# EAGLE design frontpanel (EAGLE 5.10)
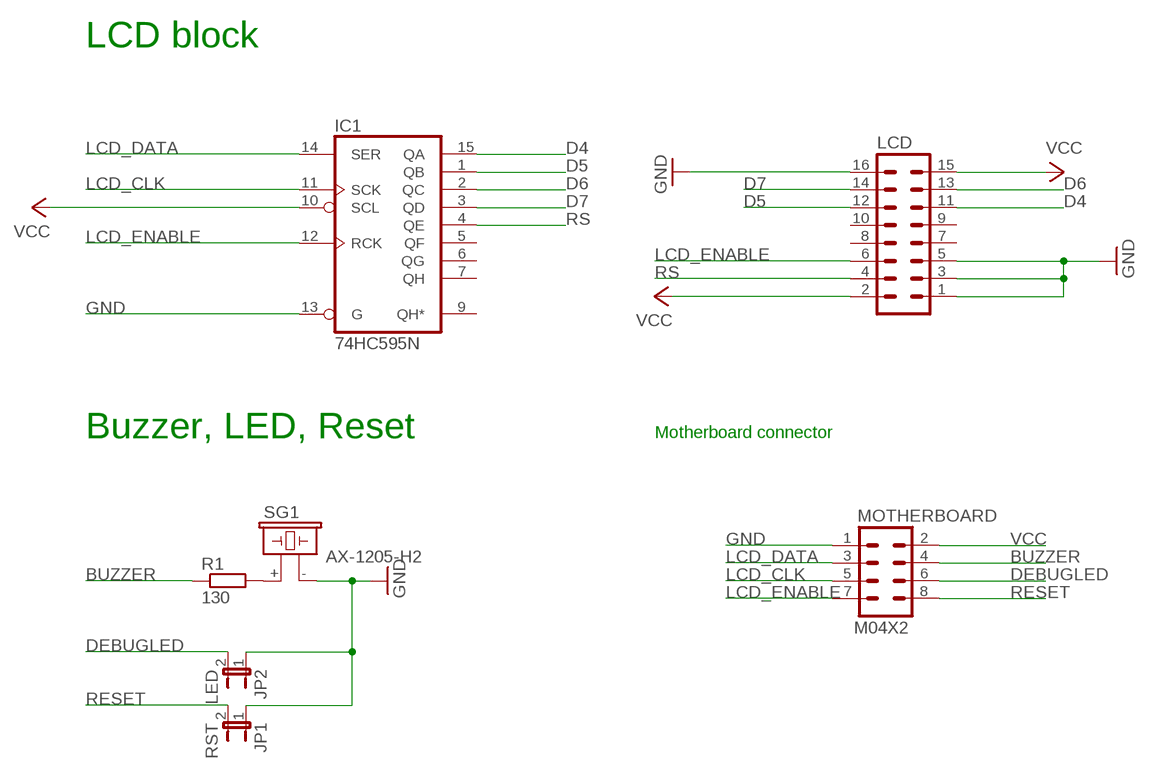
[diagram p0: schematic, sheet 1]

## Parts
IC1  74HC595N  [DIL16]
JP1  RST  JUMPER-2PTH  [1X02]
JP2  LED  JUMPER-2PTH  [1X02]
LCD  MA08-2  [MA08-2]
MOTHERBOARD  M04X2  [2X4]
R1  130  R-EU_0207/7  [0207/7]
SG1  AX-1205-H2  F/CM12P  [F/CM12P]

## Nets
BUZZER: MOTHERBOARD.4 R1.1
D4: IC1.15(QA) LCD.11
D5: IC1.1(QB) LCD.12
D6: IC1.2(QC) LCD.13
D7: IC1.3(QD) LCD.14
DEBUGLED: JP2.2 MOTHERBOARD.6
GND [GND]: IC1.13(G) JP1.1 JP2.1 LCD.1 LCD.3 LCD.5 LCD.16 MOTHERBOARD.1 SG1.-
LCD_CLK: IC1.11(SCK) MOTHERBOARD.5
LCD_DATA: IC1.14(SER) MOTHERBOARD.3
LCD_ENABLE: IC1.12(RCK) LCD.6 MOTHERBOARD.7
N$2: R1.2 SG1.+
RESET: JP1.2 MOTHERBOARD.8
RS: IC1.4(QE) LCD.4
VCC [VCC]: IC1.10(SCL) LCD.2 LCD.15 MOTHERBOARD.2
Unconnected: IC1.5(QF) IC1.6(QG) IC1.7(QH) IC1.9(QH*) LCD.7 LCD.8 LCD.9 LCD.10

## Notes on the sheet
- LCD block
- Buzzer, LED, Reset | Motherboard connector

## Power pins joined to a net without a drawn wire
GND: IC1.8(GND)
VCC: IC1.16(VCC)

## Library data of the parts
IC1 = 74xx-eu:74*595: 8-bit SHIFT REGISTER, output latch
JP1 JP2 = SparkFun:JUMPER-2: Jumper Basic 0.1" spaced jumper. Use with breakaway headers.
LCD = con-lstb:MA08-2: PIN HEADER
MOTHERBOARD = SparkFun:M04X2
R1 = resistor:R-EU_: RESISTOR, European symbol
SG1 = buzzer:F/CM12P: BUZZER Source: Buerklin

## Net classes
0 default: width 0.254 mm
1 GND: width 0.406 mm
2 VCC: width 0.406 mm

## Board
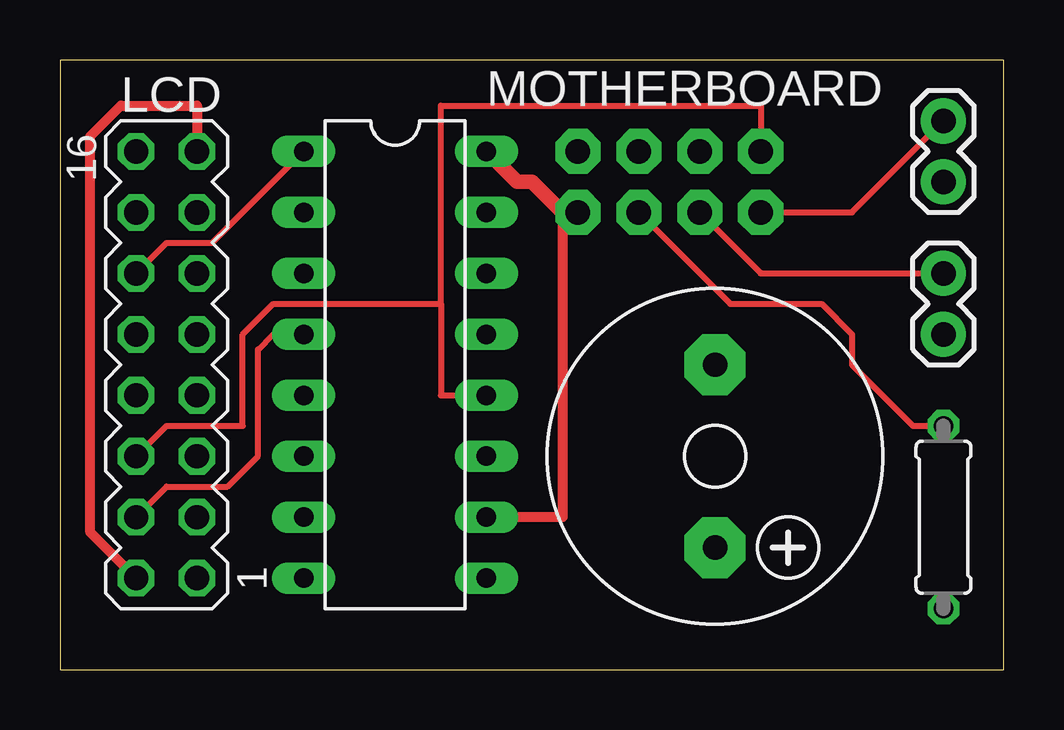
[diagram p1: board, top side]
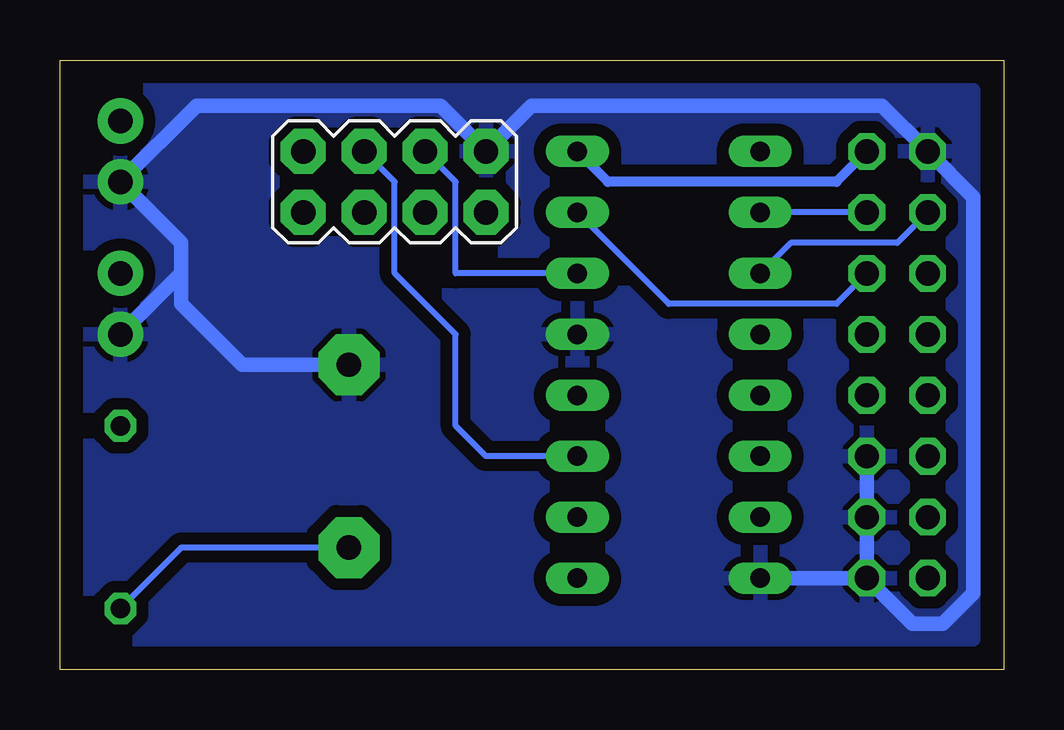
[diagram p2: board, bottom side, seen from below]

Size 39.35 x 25.4 mm. Coordinates in mm from the lower left corner, seen from the top.
Outline: 0,0 39.35,0 39.35,25.4 0,25.4 0,0
Copper layers (1*16): Top 0.018mm / dielectric 1.5mm / Bottom 0.018mm
Design rules "resonit_u18": minimum track width 0.15mm, minimum drill 0.6mm, track to track 0.15mm, track to pad 0.15mm, pad to pad 0.15mm, via to via 0.15mm, smd to smd 0.15mm, copper to edge 0.3mm, drill to drill 8mil, minimum pad ring 10mil, minimum via ring 8mil, stop-mask expansion 0.1mm, vias tented up to drill 0mil, thermal gap 10mil

### Footprints (pad centres in the part's own frame; a part is rotated, then mirrored left to right if it is on the bottom)
DIL16 = drill 0.813 long: 1 -8.89,-3.81; 2 -6.35,-3.81; 3 -3.81,-3.81; 4 -1.27,-3.81; 5 1.27,-3.81; 6 3.81,-3.81; 7 6.35,-3.81; 8 8.89,-3.81; 9 8.89,3.81; 10 6.35,3.81; 11 3.81,3.81; 12 1.27,3.81; 13 -1.27,3.81; 14 -3.81,3.81; 15 -6.35,3.81; 16 -8.89,3.81
1X02 = drill 1.016 pad 1.88 round: 1 0,0; 2 2.54,0
MA08-2 = drill 1.016 octagon: 1 -8.89,-1.27; 2 -8.89,1.27; 3 -6.35,-1.27; 4 -6.35,1.27; 5 -3.81,-1.27; 6 -3.81,1.27; 7 -1.27,-1.27; 8 -1.27,1.27; 9 1.27,-1.27; 10 1.27,1.27; 11 3.81,-1.27; 12 3.81,1.27; 13 6.35,-1.27; 14 6.35,1.27; 15 8.89,-1.27; 16 8.89,1.27
2X4 = drill 1.016 pad 1.88 octagon: 1 -3.81,-1.27; 2 -3.81,1.27; 3 -1.27,-1.27; 4 -1.27,1.27; 5 1.27,-1.27; 6 1.27,1.27; 7 3.81,-1.27; 8 3.81,1.27
0207/7 = drill 0.813 octagon: 1 -3.81,0; 2 3.81,0
F/CM12P = drill 1.016 pad 2.54 octagon: + 3.81,0; - -3.81,0

### Placement (x,y rotation side)
IC1  13.97,12.7 270 top
JP1  36.83,20.32 90 top
JP2  36.83,13.97 90 top
LCD  4.45,12.7 90 top
MOTHERBOARD  25.4,20.32 180 bottom
R1  36.83,6.35 270 top
SG1  27.3,8.89 270 top

### Tracks (layer width: path | path; a pad name or v marks a point on that pad's centre or on a via)
BUZZER
  Top 0.254: MOTHERBOARD.4 27.94,15.24 31.75,15.24 33.02,13.97 33.02,12.7 35.56,10.16 R1.1
D4
  Bottom 0.254: IC1.15 13.97,15.24 6.99,15.24 LCD.11
D5
  Top 0.254: IC1.1 6.35,17.78 4.45,17.78 LCD.12
D6
  Bottom 0.254: LCD.13 IC1.2
D7
  Bottom 0.254: IC1.3 8.89,17.78 4.45,17.78 LCD.14
DEBUGLED
  Top 0.254: MOTHERBOARD.6 29.21,16.51 JP2.2
GND
  Bottom 0.61: LCD.1 IC1.8 | LCD.1 LCD.3 LCD.5 | LCD.1 3.81,1.91 2.54,1.91 1.27,3.17 1.27,19.68 LCD.16 5.08,23.5 19.68,23.5 MOTHERBOARD.1 23.5,23.5 33.66,23.5 JP1.1 34.29,17.78 34.29,16.51 | 34.29,16.51 34.29,15.24 31.75,12.7 SG1.- | 34.29,16.51 JP2.1
  pour Bottom (isolate 0.5): 1.27,24.13 38.1,24.13 38.1,1.27 1.27,1.27
LCD_CLK
  Bottom 0.254: IC1.11 21.59,8.89 22.86,10.16 22.86,13.97 25.4,16.51 25.4,20.32 MOTHERBOARD.5
LCD_DATA
  Bottom 0.254: IC1.14 22.86,16.51 22.86,20.32 MOTHERBOARD.3
LCD_ENABLE
  Top 0.254: IC1.12 15.88,11.43 15.88,15.24 | 15.88,15.24 15.88,23.5 29.21,23.5 MOTHERBOARD.7 | LCD.6 4.45,10.16 7.62,10.16 7.62,13.97 8.89,15.24 15.88,15.24
N$2
  Bottom 0.254: R1.2 34.29,5.08 SG1.+
RESET
  Top 0.254: MOTHERBOARD.8 33.02,19.05 JP1.2
RS
  Top 0.254: LCD.4 4.45,7.62 6.99,7.62 8.26,8.89 8.26,13.33 8.89,13.97 IC1.4
VCC
  Top 0.406: IC1.10 20.95,6.35 20.95,19.05 | LCD.2 1.27,5.71 1.27,22.22 2.54,23.5 5.71,23.5 LCD.15
  Top 0.61: MOTHERBOARD.2 20.95,19.05 19.68,20.32 19.05,20.32 IC1.16
  Bottom 0.406: LCD.15 6.99,20.32 16.51,20.32 IC1.16